# Altium schematic sheet thermocouple.SchDoc
size A3
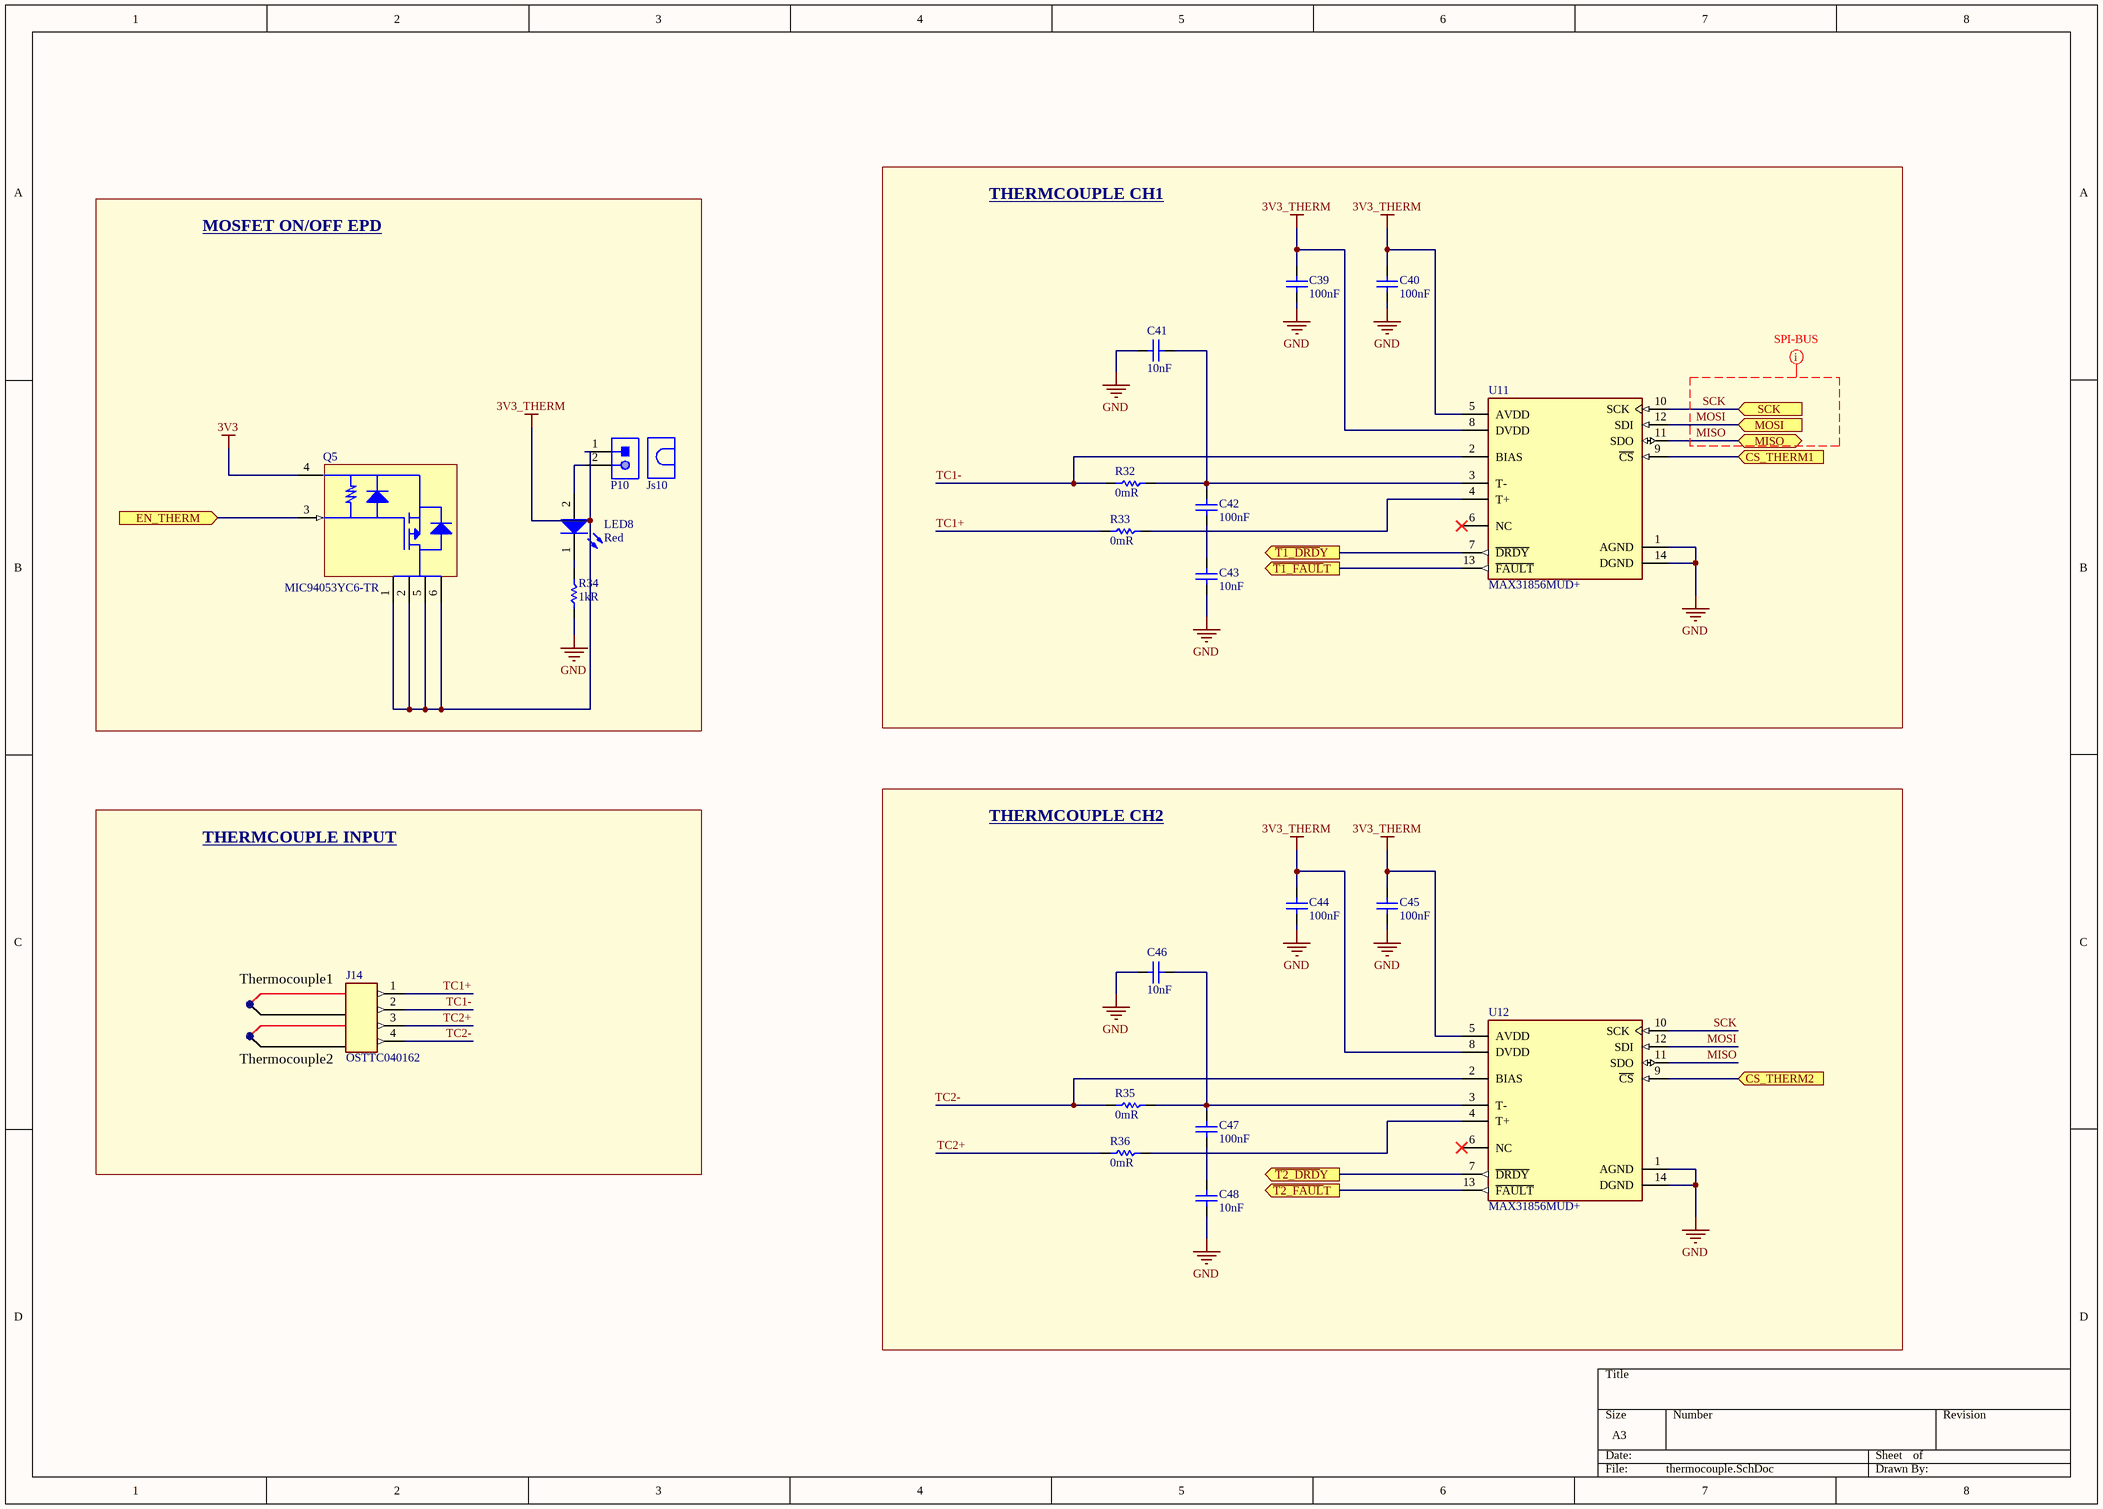
[diagram p0: thermocouple.SchDoc]

## Parts
C39  100nF  [Cap 0805 (2012 Metric)]
C40  100nF  [Cap 0805 (2012 Metric)]
C41  10nF  [Cap 0603 (1608 Metric)]
C42  100nF  [Cap 0805 (2012 Metric)]
C43  10nF  [Cap 0603 (1608 Metric)]
C44  100nF  [Cap 0805 (2012 Metric)]
C45  100nF  [Cap 0805 (2012 Metric)]
C46  10nF  [Cap 0603 (1608 Metric)]
C47  100nF  [Cap 0805 (2012 Metric)]
C48  10nF  [Cap 0603 (1608 Metric)]
J14  OSTTC040162  [OSTTC040162]
Js10  Jumper (2x1)  [Header JMP 2x1]  (value not drawn)
LED8  Red  [LED 0805(2012 METRIC)]
P10  Header 2x1  [Header 2x1]  (value not drawn)
Q5  MIC94053YC6-TR  [SC-70-6]
R32  0mR  [Res 0805 (2012 Metric)]
R33  0mR  [Res 0805 (2012 Metric)]
R34  1kR  [Res 0805 (2012 Metric)]
R35  0mR  [Res 0805 (2012 Metric)]
R36  0mR  [Res 0805 (2012 Metric)]
U11  MAX31856MUD+  [MAX31856MUD+]
U12  MAX31856MUD+  [MAX31856MUD+]

## Blocks framed on the sheet
THERMCOUPLE CH1: C39-C43 R32 R33 U11
MOSFET ON/OFF EPD: Js10 LED8 P10 Q5 R34
THERMCOUPLE INPUT: J14
THERMCOUPLE CH2: C44-C48 R35 R36 U12

## Ports
CS_THERM1 (in), CS_THERM2 (in), EN_THERM (in), MISO (bidir), MOSI (in), SCK (in), ~{T1_DRD}Y (out), ~{T1_FAUL}T (out), ~{T2_DRD}Y (out), ~{T2_FAUL}T (out)

## Nets
3V3: Q5.4(S)
3V3_THERM: C39.1 C40.1 C44.1 C45.1 P10.1 Q5.1(D) Q5.2(D) Q5.5(D) Q5.6(D) U11.5(AVDD) U11.8(DVDD) U12.5(AVDD) U12.8(DVDD)
GND: C39.2 C40.2 C41.1 C43.1 C44.2 C45.2 C46.1 C48.1 R34.2 U11.1(AGND) U11.14(DGND) U12.1(AGND) U12.14(DGND)
~{T1_DRD}Y: U11.7(~{DRDY}) ; port ~{T1_DRD}Y
~{T1_FAUL}T: U11.13(~{FAULT}) ; port ~{T1_FAUL}T
~{T2_DRD}Y: U12.7(~{DRDY}) ; port ~{T2_DRD}Y
~{T2_FAUL}T: U12.13(~{FAULT}) ; port ~{T2_FAUL}T
CS_THERM1: U11.9(~{CS}) ; port CS_THERM1
CS_THERM2: U12.9(~{CS}) ; port CS_THERM2
EN_THERM: Q5.3(G) ; port EN_THERM
MISO: U11.11(SDO) U12.11(SDO) ; port MISO
MOSI: U11.12(SDI) U12.12(SDI) ; port MOSI
SCK: U11.10(SCK) U12.10(SCK) ; port SCK
TC1+: J14.1 R33.1
TC1-: J14.2 R32.1 U11.2(BIAS)
TC2+: J14.3 R36.1
TC2-: J14.4 R35.1 U12.2(BIAS)
NetC41_2: C41.2 C42.1 R32.2 U11.3(T-)
NetC42_2: C42.2 C43.2
NetC46_2: C46.2 C47.1 R35.2 U12.3(T-)
NetC47_2: C47.2 C48.2
NetLED8_1: LED8.1(K) R34.1
NetLED8_2: LED8.2(A) P10.2
NetR33_2: R33.2 U11.4(T+)
NetR36_2: R36.2 U12.4(T+)

Not connected (* = marked no-connect by the designer): U11 6(NC)*; U12 6(NC)*

## Layout directives
net class SPI-BUS: MISO, MOSI, SCK

## Notes on the sheet
- (near J14) Thermocouple1
- (near J14) Thermocouple2

## Library data of the parts
C39 C40 C42 C44 C45 C47 = Capacitor: YAGEO (PHYCOMP)         CC0805ZRY5V9BB104             SMD Multilayer Ceramic Capacitor, 0805 [2012 Metric], 0.1 uF, 50 V, +80%, -20%, Y5V, CC Series; Tolerance: 80%; Voltage Rating: 50V; Link: https://www.digikey.com/es/products/detail/yageo/CC0805ZRY5V9BB104/2103099?s=N4IgTCBcDaIMJwAwA5EFYBaAlAmmgagJwBCxAjIgCwgC6AvkA; Supplier 1: Digi-Key; Supplier Part Number 1: 311-1361-1-ND; Manufacturer: Yageo; Manufacturer Part Number: CC0805ZRY5V9BB104; RoHS: Yes; Category: Ceramic Capacitors; Stock 1: 92689; Pricing 1: 1=0,10000, 10=0,07000, 50=0,03800, 100=0,03100, 500=0,02214, 1000=0,01739 (USD); Mount: Surface Mount; Case/Package: 0805; Number of Pins: 2; Case Code (Metric): 2012; Case Code (Imperial): 0805; Material: Ceramic; Dielectric Material: Ceramic; Min Operating Temperature: -30°C; Max Operating Temperature: 85°C; Capacitance: 100nF; Dielectric: Y5V; Package Quantity: 1; Packaging: Tape and Reel; Voltage Rating (DC): 50V; Termination: SMD/SMT; Resistor Type: Ceramic; Series: CC; Construction: Flat; Length: 2mm; Width: 0.049inch; Height: 0.6mm; Depth: 1.25mm; Thickness: 0.024inch; Radiation Hardening: No; REACH SVHC: No SVHC; Lead Free: Lead Free; Halogen Free: Halogen Free; RoHS Compliant: Yes; ComponentLink1URL: https://datasheet.ciiva.com/144/mlccorderingcode-144209.pdf?src-supplier=Digi-Key; ComponentLink1Description: https://datasheet.ciiva.com/144/mlccorderingcode-144209.pdf?src-supplier=Digi-Key; ComponentLink2URL: https://datasheet.ciiva.com/144/mlccorderingcode-144210.pdf?src-supplier=Digi-Key; ComponentLink2Description: https://datasheet.ciiva.com/144/mlccorderingcode-144210.pdf?src-supplier=Digi-Key; ComponentLink3URL: https://datasheet.ciiva.com/144/mlccorderingcode-144211.pdf?src-supplier=Digi-Key; ComponentLink3Description: https://datasheet.ciiva.com/144/mlccorderingcode-144211.pdf?src-supplier=Digi-Key; ComponentLink4URL: https://datasheet.ciiva.com/11465/upy-gphc-y5v-6-3v-to-50v-5-11465865.pdf?src-supplier=Avnet; ComponentLink4Description: https://datasheet.ciiva.com/11465/upy-gphc-y5v-6-3v-to-50v-5-11465865.pdf?src-supplier=Avnet; ComponentLink5URL: https://datasheet.ciiva.com/13389/upy-gp-np0-16v-to-50v-8-13389351.pdf?src-supplier=Mouser; ComponentLink5Description: https://datasheet.ciiva.com/13389/upy-gp-np0-16v-to-50v-8-13389351.pdf?src-supplier=Mouser; ComponentLink6URL: https://datasheet.ciiva.com/17435/upy-gphc-y5v-6-3v-to-50v-5-17435053.pdf?src-supplier=Avnet+Europe; ComponentLink6Description: https://datasheet.ciiva.com/17435/upy-gphc-y5v-6-3v-to-50v-5-17435053.pdf?src-supplier=Avnet+Europe; ComponentLink7URL: https://datasheet.ciiva.com/15189/getdatasheetpartid-55882-15189238.pdf?src-supplier=Verical; ComponentLink7Description: https://datasheet.ciiva.com/15189/getdatasheetpartid-55882-15189238.pdf?src-supplier=Verical; ComponentLink8URL: https://datasheet.ciiva.com/16747/upy-gphc-y5v-6-3v-to-50v-5-revised-16747323.pdf?src-supplier=Future+Electronics; ComponentLink8Description: https://datasheet.ciiva.com/16747/upy-gphc-y5v-6-3v-to-50v-5-revised-16747323.pdf?src-supplier=Future+Electronics; ComponentLink9URL: https://datasheet.ciiva.com/28450/1132289-28450870.pdf?src-supplier=Element14; ComponentLink9Description: https://datasheet.ciiva.com/28450/1132289-28450870.pdf?src-supplier=Element14; ComponentLink10URL: https://datasheet.ciiva.com/29241/445331-da-01-en-kerko-chip-0805-y5v0-1uf-20-80proz50vg-29241946.pdf?src-supplier=Conrad; ComponentLink10Description: https://datasheet.ciiva.com/29241/445331-da-01-en-kerko-chip-0805-y5v0-1uf-20-80proz50vg-29241946.pdf?src-supplier=Conrad
C41 C43 C46 C48 = Capacitor: Cap Ceramic 0.01uF 50V X7R 10% SMD 0603 125C Automotive T/R; Manufacturer: Yageo; Manufacturer Part Number: CC0603KRX7R9BB103; Insulation Resistance: 100GR; Link: https://www.digikey.com/es/products/detail/yageo/CC0603KRX7R9BB103/302819?s=N4IgTCBcDaIMJwAwDZEGYDSAlAGgdiwE4AhYgRnRAF0BfIA; Supplier 1: Digi-Key; Supplier Part Number 1: 311-1085-1-ND; RoHS: Yes; Category: Ceramic Capacitors; Stock 1: 1726445; Pricing 1: 1=0,10000, 10=0,03700, 50=0,02000, 100=0,01630, 500=0,01168, 1000=0,00917 (USD); Mount: Surface Mount; Case/Package: 0603; Number of Pins: 2; Case Code (Metric): 1608; Case Code (Imperial): 0603; Material: Ceramic; Min Operating Temperature: -55°C; Max Operating Temperature: 125°C; Tolerance: 10%; Packaging: Tape and Reel; Capacitance: 10nF; Dielectric: X7R; Voltage Rating: 50V; Voltage Rating (DC): 50V; Package Quantity: 1; Termination: SMD/SMT; Voltage: 50V; Series: CC; Resistor Type: Ceramic; Length: 1.6mm; Width: 0.031inch; Height: 0.8mm; Depth: 0.8mm; Thickness: 0.035inch; Radiation Hardening: No; RoHS Compliant: Yes; Lead Free: Lead Free; REACH SVHC: No SVHC; Halogen Free: Halogen Free; ComponentLink1URL: https://datasheet.ciiva.com/11788/0900766b8079c870-11788374.pdf?src-supplier=RSComponents; ComponentLink1Description: https://datasheet.ciiva.com/11788/0900766b8079c870-11788374.pdf?src-supplier=RSComponents; ComponentLink2URL: https://datasheet.ciiva.com/26862/getdatasheetpartid-403582-26862846.pdf?src-supplier=Verical; ComponentLink2Description: https://datasheet.ciiva.com/26862/getdatasheetpartid-403582-26862846.pdf?src-supplier=Verical; ComponentLink3URL: https://datasheet.ciiva.com/176/mlccorderingcode-176550.pdf?src-supplier=Digi-Key; ComponentLink3Description: https://datasheet.ciiva.com/176/mlccorderingcode-176550.pdf?src-supplier=Digi-Key; ComponentLink4URL: https://datasheet.ciiva.com/176/mlccorderingcode-176551.pdf?src-supplier=Digi-Key; ComponentLink4Description: https://datasheet.ciiva.com/176/mlccorderingcode-176551.pdf?src-supplier=Digi-Key; ComponentLink5URL: https://datasheet.ciiva.com/176/mlccorderingcode-176552.pdf?src-supplier=Digi-Key; ComponentLink5Description: https://datasheet.ciiva.com/176/mlccorderingcode-176552.pdf?src-supplier=Digi-Key; ComponentLink6URL: https://datasheet.ciiva.com/13389/upy-gphc-x7r-6-3v-to-50v-8-13389991.pdf?src-supplier=Mouser; ComponentLink6Description: https://datasheet.ciiva.com/13389/upy-gphc-x7r-6-3v-to-50v-8-13389991.pdf?src-supplier=Mouser; ComponentLink7URL: https://datasheet.ciiva.com/16625/upy-gphc-x7r-6-3v-to-50v-8-16625529.pdf?src-supplier=Avnet+Europe; ComponentLink7Description: https://datasheet.ciiva.com/16625/upy-gphc-x7r-6-3v-to-50v-8-16625529.pdf?src-supplier=Avnet+Europe; ComponentLink8URL: https://datasheet.ciiva.com/28450/1489800-28450619.pdf?src-supplier=Element14; ComponentLink8Description: https://datasheet.ciiva.com/28450/1489800-28450619.pdf?src-supplier=Element14; ComponentLink9URL: https://datasheet.ciiva.com/8033/1734573-8033816.pdf?src-supplier=Element14; ComponentLink9Description: https://datasheet.ciiva.com/8033/1734573-8033816.pdf?src-supplier=Element14; ComponentLink10URL: https://datasheet.ciiva.com/8033/70765-8033817.pdf?src-supplier=Element14; ComponentLink10Description: https://datasheet.ciiva.com/8033/70765-8033817.pdf?src-supplier=Element14; ComponentLink11URL: https://datasheet.ciiva.com/8033/1734573-8033861.pdf?src-supplier=Element14; ComponentLink11Description: https://datasheet.ciiva.com/8033/1734573-8033861.pdf?src-supplier=Element14
J14 = OSTTC040162: Conn Terminal Block 4 POS 5mm Solder ST Thru-Hole 15A; Manufacturer: On-Shore Technology; Plating: Steel; Number of Levels: 1; Number of Positions Per Level: 4; Voltage: 300V; Wire Gauge (Max): 22AWG; Wire Gauge (Min): 14AWG; Pitch: 0.197inch; Supplier 1: Digi-Key; RoHS: Yes; Category: Terminal Blocks; Stock 1: 6766; Mount: Through Hole; Number of Pins: 4; Color: Blue; Contact Plating: Tin; Housing Color: Blue; Contact Material: Brass; Housing Material: Thermoplastic; Min Operating Temperature: -30°C; Max Operating Temperature: 105°C; Packaging: Bulk; Current: 15A; Termination: Screw; Number of Positions: 4; Number of Rows: 1; Series: OSTTC; Length: 20mm; Width: 7.6mm; Height: 10mm; Flammability Rating: UL94 V-0; RoHS Compliant: Yes; ComponentLink1URL: https://datasheet.ciiva.com/825/osttcxx0162-825113.pdf?src-supplier=Digi-Key; ComponentLink1Description: https://datasheet.ciiva.com/825/osttcxx0162-825113.pdf?src-supplier=Digi-Key; Link: https://www.digikey.com/en/products/detail/on-shore-technology-inc/OSTTC040162/614551; Supplier Part Number 1: ED2602-ND; Manufacturer Part Number: OSTTC040162; Pricing 1: 1=1,29000, 10=0,80600, 25=0,68960, 50=0,62000, 100=0,60700, 250=0,51660, 500=0,49076, 1000=0,43911, 5000=0,34440 (USD)
Js10 = Jumper (2x1): 2 (1 x 2) Position Shunt Connector Black Open Top 0.100" (2.54mm) Gold; Manufacturer: Sullins; Manufacturer Part Number: QPC02SXGN-RC; Number of Positions: 2; Pitch: 0.1inch; Link: https://www.digikey.com/product-detail/en/sullins-connector-solutions/QPC02SXGN-RC/S9337-ND/2618262; Supplier 1: Digi-Key; Supplier Part Number 1: S9337-ND; RoHS: Yes; Category: Connectors; Stock 1: 529611; Pricing 1: 1=0,10000, 10=0,05900, 25=0,04400, 50=0,03780, 100=0,03650, 250=0,03152, 500=0,03024, 1000=0,02646, 2500=0,02394 (USD); Case/Package: 100; Contact Plating: Gold; Package Quantity: 2000; Packaging: Bulk; Height: 0.235inch; Lead Free: Lead Free; ComponentLink1URL: https://datasheet.ciiva.com/767/284-sxgn-11510-767869.pdf?src-supplier=Digi-Key; ComponentLink1Description: https://datasheet.ciiva.com/767/284-sxgn-11510-767869.pdf?src-supplier=Digi-Key
LED8 = LED: SMD LED red 2.4 V 0805, 150080RS75000, Würth Elektronik; Manufacturer: Wurth Electronics; Luminous Intensity: 150mcd; Viewing Angle: 140°; Forward Voltage: 2V; Wavelength: 625nm; Lens Style: Clear,Rectangular; Forward Current: 30mA; Test Current: 20mA; Link: https://www.digikey.com/es/products/detail/w%C3%BCrth-elektronik/150080RS75000/4489918?s=N4IgTCBcDaIIwFYAMSAcSBKBlA7MlIAugL5A; Supplier 1: Digi-Key; Supplier Part Number 1: 732-4984-1-ND; Manufacturer Part Number: 150080RS75000; RoHS: Yes; Category: LEDs; Stock 1: 57843; Pricing 1: 1=0,18000, 50=0,16500, 100=0,14200, 500=0,12300 (USD); Mount: Surface Mount; Case/Package: 0805; Color: Red; Case Code (Metric): 2012; Case Code (Imperial): 0805; Min Operating Temperature: -40°C; Max Operating Temperature: 85°C; Package Quantity: 4000; Packaging: Tape and Reel; Dominant Wavelength: 625nm; Length: 2mm; Width: 1.25mm; Height: 0.7mm; REACH SVHC: Unknown; RoHS Compliant: Yes; ComponentLink1URL: https://datasheet.ciiva.com/22656/150080rs75000-22656961.pdf?src-supplier=Element14; ComponentLink1Description: https://datasheet.ciiva.com/22656/150080rs75000-22656961.pdf?src-supplier=Element14; ComponentLink2URL: https://datasheet.ciiva.com/29279/759435-da-01-en-chipled-0805-w-kl-rot-150080rs75000-29279032.pdf?src-supplier=Conrad; ComponentLink2Description: https://datasheet.ciiva.com/29279/759435-da-01-en-chipled-0805-w-kl-rot-150080rs75000-29279032.pdf?src-supplier=Conrad
P10 = Header 2x1: Connector Header Through Hole 2 position 0.100" (2.54mm); Manufacturer: Amphenol FCI; Manufacturer Part Number: 68001-402HLF; Number of Contacts: 2; Connector Type: Male Pin; Insulation Resistance: 5GR; Max Voltage Rating (AC): 1.5kV; Gender: Male; Current Rating: 3A; Contact Post Length: 3.05mm; Link: https://www.digikey.com/product-detail/en/amphenol-icc-fci/68001-402HLF/609-3507-ND/1530472; Supplier 1: Digi-Key; Supplier Part Number 1: 609-3507-ND; RoHS: Yes; Category: Headers and Wire Housings; Stock 1: 5598; Pricing 1: 1=0,12000, 10=0,11600, 100=0,07160, 500=0,05928, 1000=0,05187, 5000=0,04446, 10000=0,04323 (USD); Mount: Through Hole; Contact Plating: Tin; Housing Material: Thermoplastic; Housing Color: Black; Color: Black; Contact Material: Bronze; Min Operating Temperature: -65°C; Max Operating Temperature: 125°C; Termination: Solder; Number of Rows: 1; Number of Positions: 2; Orientation: Straight; Package Quantity: 100; Packaging: Bulk; Contact Gender: Male; Voltage Rating: 1.5kV; Length: 5.08mm; Pitch: 2.54mm; Contact Mating Length: 0.23inch; Depth: 2.41mm; Radiation Hardening: No; REACH SVHC: No SVHC; Flammability Rating: UL94 V-0; Lead Free: Lead Free; ComponentLink1URL: https://datasheet.ciiva.com/724/68000-724389.pdf?src-supplier=Digi-Key; ComponentLink1Description: https://datasheet.ciiva.com/724/68000-724389.pdf?src-supplier=Digi-Key; ComponentLink2URL: https://datasheet.ciiva.com/16726/68000-16726185.pdf?src-supplier=Avnet+Europe; ComponentLink2Description: https://datasheet.ciiva.com/16726/68000-16726185.pdf?src-supplier=Avnet+Europe; ComponentLink3URL: https://datasheet.ciiva.com/10149/68000-10149338.pdf?src-supplier=Avnet; ComponentLink3Description: https://datasheet.ciiva.com/10149/68000-10149338.pdf?src-supplier=Avnet; ComponentLink4URL: https://datasheet.ciiva.com/46385/1748756-46385306.pdf?src-supplier=Element14; ComponentLink4Description: https://datasheet.ciiva.com/46385/1748756-46385306.pdf?src-supplier=Element14
Q5 = TransistorMosfet(Load): P-Channel 6V 2A (Ta) 270mW (Ta) Surface Mount SC-70-6; Manufacturer: Microchip; Link: https://www.digikey.com/product-detail/en/microchip-technology/MIC94053YC6-TR/576-2939-1-ND/1822099; Supplier 1: Digi-Key; Supplier Part Number 1: 576-2939-1-ND; Manufacturer Part Number: MIC94053YC6-TR; RoHS: Yes; Category: MOSFETs; Stock 1: 3005; Pricing 1: 1=0,58000, 25=0,48000, 100=0,46250 (USD); ComponentLink1URL: https://datasheet.ciiva.com/6379/mic94052-53-6379193.pdf?src-supplier=Digi-Key; ComponentLink1Description: https://datasheet.ciiva.com/6379/mic94052-53-6379193.pdf?src-supplier=Digi-Key; ComponentLink2URL: https://datasheet.ciiva.com/6379/mic94052-53-6379189.pdf?src-supplier=Digi-Key; ComponentLink2Description: https://datasheet.ciiva.com/6379/mic94052-53-6379189.pdf?src-supplier=Digi-Key; ComponentLink3URL: https://datasheet.ciiva.com/46408/264781-46408581.pdf?src-supplier=Element14; ComponentLink3Description: https://datasheet.ciiva.com/46408/264781-46408581.pdf?src-supplier=Element14; ComponentLink4URL: https://datasheet.ciiva.com/15200/getdatasheetpartid-111629-15200795.pdf?src-supplier=Verical; ComponentLink4Description: https://datasheet.ciiva.com/15200/getdatasheetpartid-111629-15200795.pdf?src-supplier=Verical
R32 R33 R35 R36 = Resistor: CR Series 0805 0 O Jumper Surface Mount Thick Film Chip Resistor; Manufacturer: Viking Tech; Manufacturer Part Number: CR-05JL7----0R; Power Rating: 125mW; Tolerance: 5%; Link: https://www.digikey.com/es/products/detail/viking-tech/CR-05JL7-0R/12141914; Supplier 1: Future Electronics; Supplier Part Number 1: 9059663; RoHS: Yes; Category: Chip SMD Resistors; Pricing 1: 5000=0,00480, 20000=0,00400, 50000=0,00400, 125000=0,00390, 200000=0,00390 (USD); Mount: Surface Mount; Case/Package: 0805; Min Operating Temperature: -55°C; Max Operating Temperature: 155°C; Resistance: 0mR; Termination: Solder; Length: 2mm; Height: 0.5mm; Depth: 1.25mm; Lead Free: Lead Free; RoHS Compliant: Yes
R34 = Resistor: RES 1K OHM 1% 1/4W 0805; Manufacturer: Stackpole Electronics; Manufacturer Part Number: RNCP0805FTD1K00; Power Rating: 250mW; Temperature Coefficient: 100ppm/°C; Link: https://www.digikey.com/es/products/detail/stackpole-electronics-inc/RNCP0805FTD1K00/2240229?s=N4IgTCBcDaIEoDkDCAFADADjQVgGIBUARARgGk00QBdAXyA; Supplier 1: Digi-Key; Supplier Part Number 1: RNCP0805FTD1K00CT-ND; RoHS: Yes; Category: Chip SMD Resistors; Stock 1: 316834; Pricing 1: 1=0,10000, 10=0,07000, 100=0,02830, 1000=0,01272, 2500=0,01104 (USD); Mount: Surface Mount; Case/Package: 0805; Case Code (Metric): 2012; Case Code (Imperial): 0805; Size Code: 0805; Min Operating Temperature: -55°C; Max Operating Temperature: 155°C; Tolerance: 1%; Resistance: 1kR; Packaging: Tape and Reel; Resistor Type: Thin Film; Number of Terminations: 2; Max Power Dissipation: 250mW; Features: Moisture Resistant,Anti-Sulfur; Series: RNCP; Length: 0.079inch; Width: 0.049inch; Height: 0.024inch; Lead Free: Lead Free; RoHS Compliant: Yes; ComponentLink1URL: https://www.seielect.com/catalog/SEI-Packaging.pdf?src-supplier=Digi-Key; ComponentLink1Description: https://www.seielect.com/catalog/SEI-Packaging.pdf?src-supplier=Digi-Key; ComponentLink2URL: https://www.seielect.com/Catalog/SEI-rncp.pdf?src-supplier=Digi-Key; ComponentLink2Description: https://www.seielect.com/Catalog/SEI-rncp.pdf?src-supplier=Digi-Key; ComponentLink3URL: http://www.seielect.com/Catalog/SEI-rncp.pdf?src-supplier=Future+Electronics; ComponentLink3Description: http://www.seielect.com/Catalog/SEI-rncp.pdf?src-supplier=Future+Electronics
U11 U12 = MAX31856MUD+: Precision Thermocouple to Digital Converter 14-Pin TSSOP Tube; Manufacturer: Maxim; Interface: SPI; Operating Supply Current: 1.2mA; Min Supply Voltage: 3V; Max Supply Voltage: 3.6V; Supplier 1: RSComponents; RoHS: Yes; Category: Temperature and Humidity Sensors; Stock 1: 1344; Mount: Surface Mount; Case/Package: TSSOP; Number of Pins: 14; Min Operating Temperature: -55°C; Max Operating Temperature: 125°C; Packaging: Rail/Tube; Output Type: Digital; RoHS Compliant: Yes; REACH SVHC: Unknown; ComponentLink1URL: http://www.farnell.com/datasheets/2025711.pdf?src-supplier=Farnell; ComponentLink1Description: http://www.farnell.com/datasheets/2025711.pdf?src-supplier=Farnell; ComponentLink2URL: https://media.digikey.com/pdf/Data%20Sheets/Maxim%20PDFs/PartNumberBreakdown_ds.pdf?src-supplier=Digi-Key; ComponentLink2Description: https://media.digikey.com/pdf/Data%20Sheets/Maxim%20PDFs/PartNumberBreakdown_ds.pdf?src-supplier=Digi-Key; ComponentLink3URL: http://datasheets.maximintegrated.com/en/ds/MAX31856.pdf?src-supplier=Avnet; ComponentLink3Description: http://datasheets.maximintegrated.com/en/ds/MAX31856.pdf?src-supplier=Avnet; ComponentLink4URL: http://www.farnell.com/datasheets/2025711.pdf?src-supplier=Newark; ComponentLink4Description: http://www.farnell.com/datasheets/2025711.pdf?src-supplier=Newark; ComponentLink5URL: http://www.farnell.com/datasheets/2002032.pdf?src-supplier=Element14; ComponentLink5Description: http://www.farnell.com/datasheets/2002032.pdf?src-supplier=Element14; Link: https://www.digikey.com/en/products/detail/MAX31856MUD%2b/MAX31856MUD%2b-ND/5050138?itemSeq=376683530; Supplier Part Number 1: 1904800; Manufacturer Part Number: MAX31856MUD+; Pricing 1: 96=4,87600, 192=4,03700, 288=3,94500 (GBP)